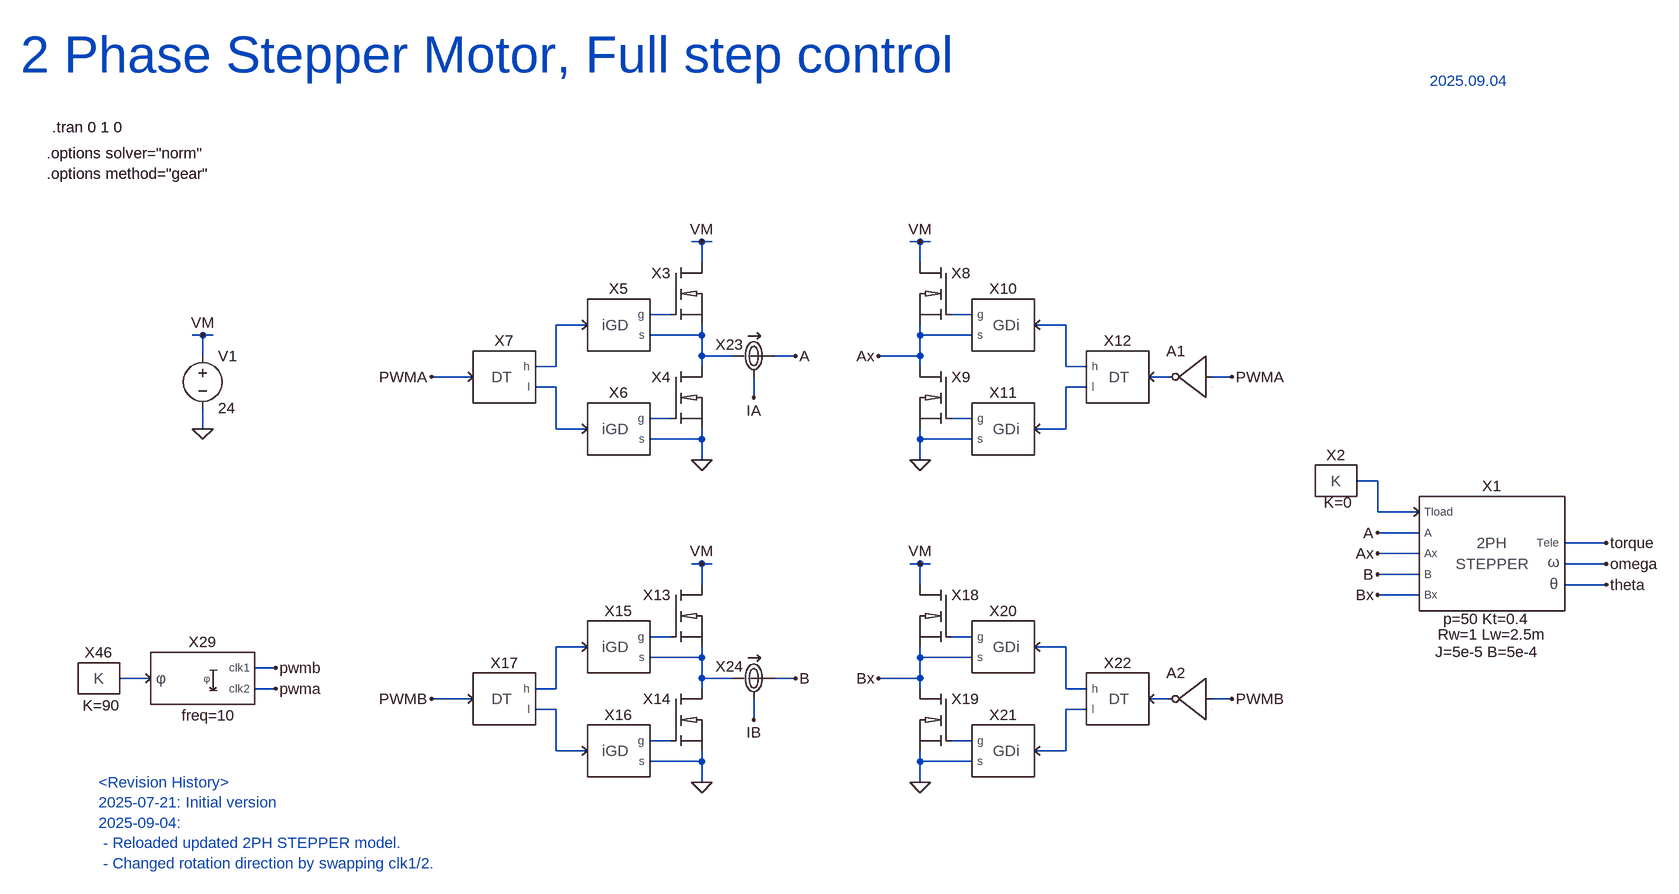
[diagram p0: schematic STEP2PH_FSTEP.asc]
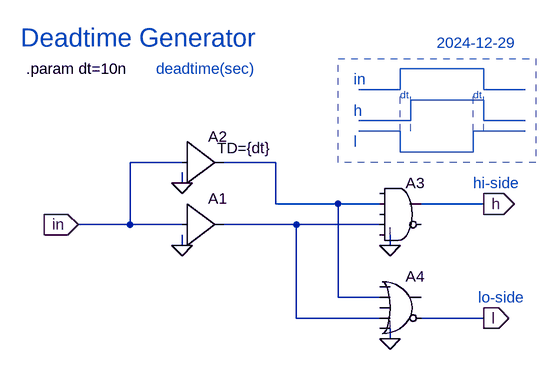
[diagram p1: sub-circuit deadtime.asc]
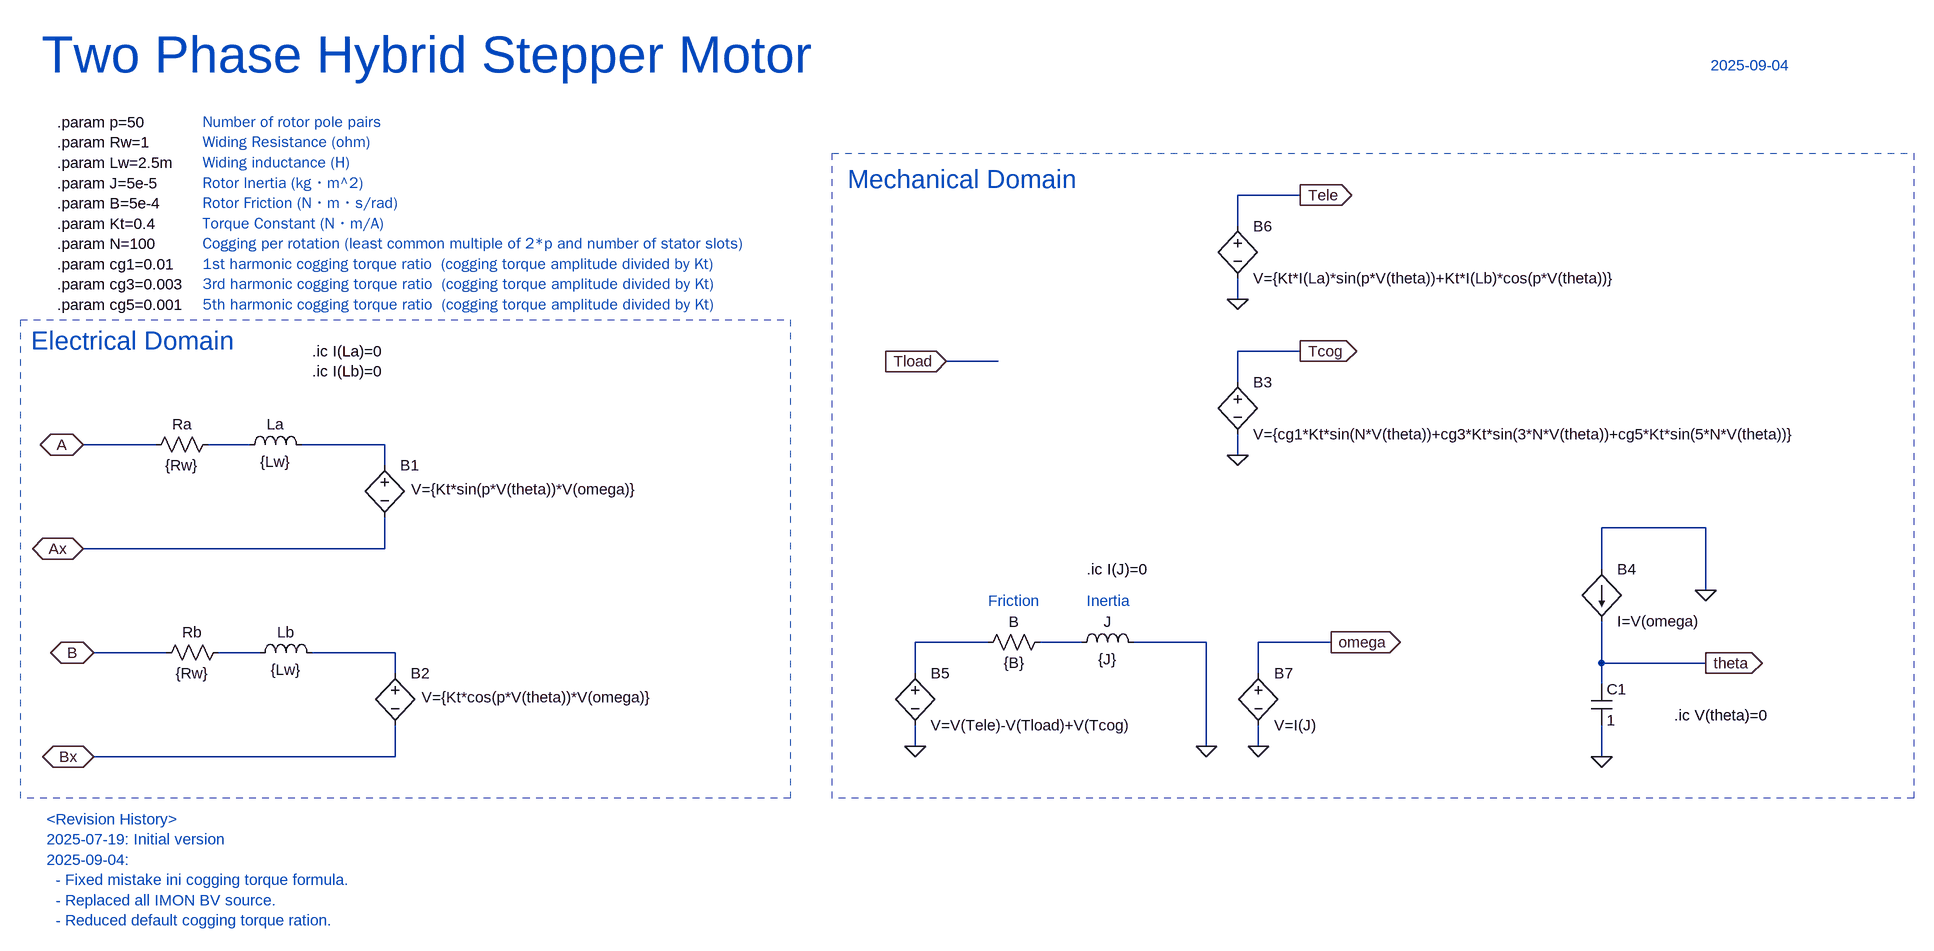
[diagram p2: sub-circuit stepper_2ph.asc]
STEP2PH_FSTEP.asc, the LTspice schematic file:
Version 4.1
SHEET 1 1580 2284
WIRE -288 -160 -304 -160
WIRE -272 -160 -288 -160
WIRE 48 -160 32 -160
WIRE 64 -160 48 -160
WIRE -288 -128 -288 -160
WIRE 48 -128 48 -160
WIRE -336 -48 -368 -48
WIRE 128 -48 96 -48
WIRE -464 -32 -512 -32
WIRE 272 -32 224 -32
WIRE -1056 -16 -1072 -16
WIRE -1040 -16 -1056 -16
WIRE -288 -16 -288 -32
WIRE -288 -16 -368 -16
WIRE 48 -16 48 -32
WIRE 128 -16 48 -16
WIRE -1056 16 -1056 -16
WIRE -288 16 -288 -16
WIRE -240 16 -288 16
WIRE -144 16 -176 16
WIRE 48 16 48 -16
WIRE 48 16 -16 16
WIRE -512 32 -512 -32
WIRE -512 32 -544 32
WIRE -288 32 -288 16
WIRE 48 32 48 16
WIRE 272 32 272 -32
WIRE 304 32 272 32
WIRE -640 48 -704 48
WIRE 432 48 400 48
WIRE 528 48 496 48
WIRE -512 64 -544 64
WIRE 304 64 272 64
WIRE -208 80 -208 48
WIRE -336 112 -368 112
WIRE 128 112 96 112
WIRE -1056 128 -1056 96
WIRE -512 128 -512 64
WIRE -464 128 -512 128
WIRE 272 128 272 64
WIRE 272 128 224 128
WIRE -288 144 -288 128
WIRE -288 144 -368 144
WIRE 48 144 48 128
WIRE 128 144 48 144
WIRE -288 176 -288 144
WIRE 48 176 48 144
WIRE 752 208 720 208
WIRE 752 256 752 208
WIRE 816 256 752 256
WIRE 816 288 752 288
WIRE 1104 304 1040 304
WIRE 816 320 752 320
WIRE -288 336 -304 336
WIRE -272 336 -288 336
WIRE 48 336 32 336
WIRE 64 336 48 336
WIRE 1104 336 1040 336
WIRE 816 352 752 352
WIRE -288 368 -288 336
WIRE 48 368 48 336
WIRE 1104 368 1040 368
WIRE 816 384 752 384
WIRE -336 448 -368 448
WIRE 128 448 96 448
WIRE -464 464 -512 464
WIRE 272 464 224 464
WIRE -288 480 -288 464
WIRE -288 480 -368 480
WIRE 48 480 48 464
WIRE 128 480 48 480
WIRE -944 496 -976 496
WIRE -1136 512 -1184 512
WIRE -288 512 -288 480
WIRE -240 512 -288 512
WIRE -144 512 -176 512
WIRE 48 512 48 480
WIRE 48 512 -16 512
WIRE -944 528 -976 528
WIRE -512 528 -512 464
WIRE -512 528 -544 528
WIRE -288 528 -288 512
WIRE 48 528 48 512
WIRE 272 528 272 464
WIRE 304 528 272 528
WIRE -640 544 -704 544
WIRE 432 544 400 544
WIRE 528 544 496 544
WIRE -512 560 -544 560
WIRE 304 560 272 560
WIRE -208 576 -208 544
WIRE -336 608 -368 608
WIRE 128 608 96 608
WIRE -512 624 -512 560
WIRE -464 624 -512 624
WIRE 272 624 272 560
WIRE 272 624 224 624
WIRE -288 640 -288 624
WIRE -288 640 -368 640
WIRE 48 640 48 624
WIRE 128 640 48 640
WIRE -288 672 -288 640
WIRE 48 672 48 640
FLAG 1104 336 omega
FLAG 1104 368 theta
FLAG -288 176 0
FLAG -144 16 A
FLAG 752 288 A
FLAG 752 320 Ax
FLAG 752 352 B
FLAG 752 384 Bx
FLAG -288 -160 VM
FLAG 48 176 0
FLAG -16 16 Ax
FLAG 48 -160 VM
FLAG -704 48 PWMA
FLAG 528 48 PWMA
FLAG 1104 304 torque
FLAG -288 672 0
FLAG -144 512 B
FLAG -288 336 VM
FLAG 48 672 0
FLAG -16 512 Bx
FLAG 48 336 VM
FLAG -704 544 PWMB
FLAG 528 544 PWMB
FLAG -1056 128 0
FLAG -1056 -16 VM
FLAG -208 80 IA
FLAG -208 576 IB
FLAG -944 496 pwmb
FLAG -944 528 pwma
SYMBOL CONST 688 208 R0
WINDOW 39 3 49 Bottom 2
SYMATTR SpiceLine K=0
SYMATTR InstName X2
SYMBOL iNMOS -288 -80 R0
SYMATTR InstName X3
SYMBOL iNMOS -288 80 R0
SYMATTR InstName X4
SYMBOL iGD -416 -32 R0
SYMATTR InstName X5
SYMBOL iGD -416 128 R0
SYMATTR InstName X6
SYMBOL DEADTIME -592 48 R0
SYMATTR InstName X7
SYMBOL iNMOS 48 -80 M0
SYMATTR InstName X8
SYMBOL iNMOS 48 80 M0
SYMATTR InstName X9
SYMBOL iGD 176 -32 M0
SYMATTR InstName X10
SYMBOL iGD 176 128 M0
SYMATTR InstName X11
SYMBOL DEADTIME 352 48 M0
SYMATTR InstName X12
SYMBOL Digital\\inv 496 -16 M0
SYMATTR InstName A1
SYMBOL iNMOS -288 416 R0
SYMATTR InstName X13
SYMBOL iNMOS -288 576 R0
SYMATTR InstName X14
SYMBOL iGD -416 464 R0
SYMATTR InstName X15
SYMBOL iGD -416 624 R0
SYMATTR InstName X16
SYMBOL DEADTIME -592 544 R0
SYMATTR InstName X17
SYMBOL iNMOS 48 416 M0
SYMATTR InstName X18
SYMBOL iNMOS 48 576 M0
SYMATTR InstName X19
SYMBOL iGD 176 464 M0
SYMATTR InstName X20
SYMBOL iGD 176 624 M0
SYMATTR InstName X21
SYMBOL DEADTIME 352 544 M0
SYMATTR InstName X22
SYMBOL Digital\\inv 496 480 M0
SYMATTR InstName A2
SYMBOL voltage -1056 0 R0
SYMATTR InstName V1
SYMATTR Value 24
SYMBOL IMON -208 16 R0
SYMATTR InstName X23
SYMBOL IMON -208 512 R0
SYMATTR InstName X24
SYMBOL PHASESHIFT -1056 512 R0
WINDOW 39 9 73 Bottom 2
SYMATTR SpiceLine freq=10
SYMATTR InstName X29
SYMBOL CONST -1216 512 R0
WINDOW 39 4 57 Bottom 2
SYMATTR SpiceLine K=90
SYMATTR InstName X46
SYMBOL STEPPER_2PH 928 320 R0
WINDOW 3 -9 116 Bottom 2
WINDOW 123 1 140 Bottom 2
WINDOW 39 -7 167 Bottom 2
SYMATTR InstName X1
TEXT -1288 -336 Left 2 !.tran 0 1 0
TEXT -1296 -296 Left 2 !.options solver="norm"\n.options method="gear"
TEXT -1336 -448 Left 6 ;2 Phase Stepper Motor, Full step control
TEXT 832 -408 Left 2 ;2025.09.04
TEXT -1216 672 Left 2 ;<Revision History>\n2025-07-21: Initial version\n2025-09-04: \n - Reloaded updated 2PH STEPPER model.\n - Changed rotation direction by swapping clk1/2.

deadtime.asc, the sub-circuit schematic file:
Version 4
SHEET 1 1412 1312
WIRE 64 288 -16 288
WIRE 208 288 128 288
WIRE 64 320 64 304
WIRE 208 352 208 288
WIRE 304 352 208 352
WIRE 368 352 304 352
WIRE 528 352 432 352
WIRE -16 384 -16 288
WIRE -16 384 -96 384
WIRE 64 384 -16 384
WIRE 240 384 128 384
WIRE 368 384 240 384
WIRE 64 416 64 400
WIRE 384 416 384 400
WIRE 304 496 304 352
WIRE 368 496 304 496
WIRE 240 528 240 384
WIRE 368 528 240 528
WIRE 528 528 432 528
WIRE 384 560 384 544
FLAG -96 384 in
IOPIN -96 384 In
FLAG 64 416 0
FLAG 64 320 0
FLAG 384 416 0
FLAG 384 560 0
FLAG 528 352 h
IOPIN 528 352 Out
FLAG 528 528 l
IOPIN 528 528 Out
SYMBOL Digital\\buf1 64 320 R0
SYMATTR InstName A1
SYMBOL Digital\\buf1 64 224 R0
WINDOW 3 54 42 Left 2
SYMATTR Value TD={dt}
SYMATTR InstName A2
SYMBOL Digital\\and 400 304 R0
SYMATTR InstName A3
SYMBOL Digital\\or 400 448 R0
SYMATTR InstName A4
TEXT -176 144 Left 2 !.param dt=10n
TEXT -184 96 Left 4 ;Deadtime Generator
TEXT 24 144 Left 2 ;deadtime(sec)
TEXT 512 320 Left 2 ;hi-side
TEXT 520 496 Left 2 ;lo-side
TEXT 328 160 Left 2 ;in
TEXT 328 208 Left 2 ;h
TEXT 328 256 Left 2 ;l
TEXT 400 184 Left 1 ;dt
TEXT 512 184 Left 1 ;dt
TEXT 456 104 Left 2 ;2024-12-29
LINE Normal 400 176 336 176
LINE Normal 400 176 400 144
LINE Normal 528 144 400 144
LINE Normal 528 176 528 144
LINE Normal 592 176 528 176
LINE Normal 416 224 336 224
LINE Normal 416 224 416 192
LINE Normal 528 192 416 192
LINE Normal 528 224 528 192
LINE Normal 592 224 528 224
LINE Normal 400 240 336 240
LINE Normal 400 272 400 240
LINE Normal 512 272 400 272
LINE Normal 512 272 512 240
LINE Normal 592 240 512 240
LINE Normal 400 240 400 176 2
LINE Normal 512 240 512 176 2
LINE Normal 416 240 416 176 2
LINE Normal 528 240 528 176 2
RECTANGLE Normal 608 288 304 128 2

stepper_2ph.asc, the sub-circuit schematic file:
Version 4.1
SHEET 1 2756 2296
WIRE 1808 256 1712 256
WIRE 1712 304 1712 256
WIRE 1712 416 1712 384
WIRE 1808 496 1712 496
WIRE 1344 512 1264 512
WIRE 1712 544 1712 496
WIRE 48 640 -64 640
WIRE 192 640 128 640
WIRE 400 640 272 640
WIRE 1712 656 1712 624
WIRE 400 672 400 640
WIRE 2432 768 2272 768
WIRE 400 800 400 752
WIRE 400 800 -64 800
WIRE 2272 832 2272 768
WIRE 2432 864 2432 768
WIRE 1328 944 1216 944
WIRE 1472 944 1408 944
WIRE 1664 944 1552 944
WIRE 1856 944 1744 944
WIRE 64 960 -48 960
WIRE 208 960 144 960
WIRE 416 960 288 960
WIRE 2272 976 2272 912
WIRE 2432 976 2272 976
WIRE 416 992 416 960
WIRE 1216 992 1216 944
WIRE 1744 992 1744 944
WIRE 2272 1008 2272 976
WIRE 1216 1104 1216 1072
WIRE 1664 1104 1664 944
WIRE 1744 1104 1744 1072
WIRE 416 1120 416 1072
WIRE 416 1120 -48 1120
WIRE 2272 1120 2272 1072
FLAG 1712 656 0
FLAG 1216 1104 0
FLAG 2272 1120 0
FLAG 1264 512 Tload
IOPIN 1264 512 In
FLAG -64 640 A
IOPIN -64 640 BiDir
FLAG -64 800 Ax
IOPIN -64 800 BiDir
FLAG -48 960 B
IOPIN -48 960 BiDir
FLAG -48 1120 Bx
IOPIN -48 1120 BiDir
FLAG 2432 976 theta
IOPIN 2432 976 Out
FLAG 1808 496 Tcog
IOPIN 1808 496 Out
FLAG 1664 1104 0
FLAG 2432 864 0
FLAG 1712 416 0
FLAG 1808 256 Tele
IOPIN 1808 256 Out
FLAG 1744 1104 0
FLAG 1856 944 omega
IOPIN 1856 944 Out
SYMBOL res 144 624 R90
WINDOW 0 0 56 VBottom 2
WINDOW 3 32 56 VTop 2
SYMATTR InstName Ra
SYMATTR Value {Rw}
SYMBOL ind 176 656 R270
WINDOW 0 32 56 VTop 2
WINDOW 3 5 56 VBottom 2
SYMATTR InstName La
SYMATTR Value {Lw}
SYMBOL res 160 944 R90
WINDOW 0 0 56 VBottom 2
WINDOW 3 32 56 VTop 2
SYMATTR InstName Rb
SYMATTR Value {Rw}
SYMBOL ind 192 976 R270
WINDOW 0 32 56 VTop 2
WINDOW 3 5 56 VBottom 2
SYMATTR InstName Lb
SYMATTR Value {Lw}
SYMBOL bv 416 976 R0
WINDOW 3 41 53 Left 2
SYMATTR Value V={Kt*cos(p*V(theta))*V(omega)}
SYMATTR InstName B2
SYMBOL bv 1712 528 R0
SYMATTR InstName B3
SYMATTR Value V={cg1*Kt*sin(N*V(theta))+cg3*Kt*sin(3*N*V(theta))+cg5*Kt*sin(5*N*V(theta))}
SYMBOL ind 1456 960 R270
WINDOW 0 32 56 VTop 2
WINDOW 3 5 56 VBottom 2
SYMATTR InstName J
SYMATTR Value {J}
SYMBOL bv 1216 976 R0
SYMATTR InstName B5
SYMATTR Value V=V(Tele)-V(Tload)+V(Tcog)
SYMBOL cap 2256 1008 R0
SYMATTR InstName C1
SYMATTR Value 1
SYMBOL res 1424 928 R90
WINDOW 0 0 56 VBottom 2
WINDOW 3 32 56 VTop 2
SYMATTR InstName B
SYMATTR Value {B}
SYMBOL bi 2272 832 R0
SYMATTR InstName B4
SYMATTR Value I=V(omega)
SYMBOL bv 400 656 R0
WINDOW 3 41 53 Left 2
SYMATTR Value V={Kt*sin(p*V(theta))*V(omega)}
SYMATTR InstName B1
SYMBOL bv 1712 288 R0
SYMATTR InstName B6
SYMATTR Value V={Kt*I(La)*sin(p*V(theta))+Kt*I(Lb)*cos(p*V(theta))}
SYMBOL bv 1744 976 R0
SYMATTR InstName B7
SYMATTR Value V=I(J)
TEXT -104 144 Left 2 !.param p=50\n.param Rw=1\n.param Lw=2.5m\n.param J=5e-5\n.param B=5e-4\n.param Kt=0.4\n.param N=100\n.param cg1=0.01\n.param cg3=0.003\n.param cg5=0.001
TEXT -128 40 Left 6 ;Two Phase Hybrid Stepper Motor
TEXT 2440 56 Left 2 ;2025-09-04
TEXT 2384 1056 Left 2 !.ic V(theta)=0
TEXT 1480 832 Left 2 !.ic I(J)=0
TEXT 1480 880 Left 2 ;Inertia
TEXT 1328 880 Left 2 ;Friction
TEXT 288 496 Left 2 !.ic I(La)=0\n.ic I(Lb)=0
TEXT 120 144 Left 2 ;Number of rotor pole pairs\nWiding Resistance (ohm)\nWiding inductance (H)\nRotor Inertia (kg・m^2)\nRotor Friction (N・m・s/rad)\nTorque Constant (N・m/A)\nCogging per rotation (least common multiple of 2*p and number of stator slots)\n1st harmonic cogging torque ratio  (cogging torque amplitude divided by Kt)\n3rd harmonic cogging torque ratio  (cogging torque amplitude divided by Kt)\n5th harmonic cogging torque ratio  (cogging torque amplitude divided by Kt)
TEXT -120 1216 Left 2 ;<Revision History>\n2025-07-19: Initial version\n2025-09-04: \n  - Fixed mistake ini cogging torque formula.\n  - Replaced all IMON BV source.\n  - Reduced default cogging torque ration.
TEXT -144 480 Left 4 ;Electrical Domain
TEXT 1112 232 Left 4 ;Mechanical Domain
RECTANGLE Normal 1024 1184 -160 448 2
RECTANGLE Normal 2752 1184 1088 192 2

The netlist it stands for:
* STEP2PH_FSTEP.asc
X§X2 N011 CONST K=0  ; pins K
X§X3 VM N001 N005 iNMOS params: esl=1f rsnb=1k csnb=10p ron=10m  ; pins D G S
X§X4 N005 N009 0 iNMOS params: esl=1f rsnb=1k csnb=10p ron=10m  ; pins D G S
X§X5 N003 N001 N005 iGD  ; pins in g s
X§X6 N007 N009 0 iGD  ; pins in g s
X§X7 PWMA N007 N003 deadtime params: dt=10n
X§X8 VM N002 Ax iNMOS params: esl=1f rsnb=1k csnb=10p ron=10m  ; pins D G S
X§X9 Ax N010 0 iNMOS params: esl=1f rsnb=1k csnb=10p ron=10m  ; pins D G S
X§X10 N004 N002 Ax iGD  ; pins in g s
X§X11 N008 N010 0 iGD  ; pins in g s
X§X12 N006 N008 N004 deadtime params: dt=10n
A1 PWMA 0 0 0 0 N006 0 0 BUF
X§X13 VM N012 N016 iNMOS params: esl=1f rsnb=1k csnb=10p ron=10m  ; pins D G S
X§X14 N016 N021 0 iNMOS params: esl=1f rsnb=1k csnb=10p ron=10m  ; pins D G S
X§X15 N014 N012 N016 iGD  ; pins in g s
X§X16 N019 N021 0 iGD  ; pins in g s
X§X17 PWMB N019 N014 deadtime params: dt=10n
X§X18 VM N013 Bx iNMOS params: esl=1f rsnb=1k csnb=10p ron=10m  ; pins D G S
X§X19 Bx N022 0 iNMOS params: esl=1f rsnb=1k csnb=10p ron=10m  ; pins D G S
X§X20 N015 N013 Bx iGD  ; pins in g s
X§X21 N020 N022 0 iGD  ; pins in g s
X§X22 N018 N020 N015 deadtime params: dt=10n
A2 PWMB 0 0 0 0 N018 0 0 BUF
V1 VM 0 24
X§X23 A IA N005 IMON rsns=10u  ; pins n out p
X§X24 B IB N016 IMON rsns=10u  ; pins n out p
X§X29 N017 PWMB PWMA PHASESHIFT freq=10  ; pins phase clk1 clk2
X§X46 N017 CONST K=90  ; pins K
X§X1 N011 A Ax B Bx omega torque theta stepper_2ph params: p=50 Kt=0.4 Rw=1 Lw=2.5m J=5e-5 B=5e-4 N=100 cg1=0.05 cg3=0.015 cg5=0.005

* block symbol definitions
.subckt deadtime in l h
A1 in 0 0 0 0 0 N002 0 BUF
A2 in 0 0 0 0 0 N001 0 BUF TD={dt}
A3 0 N001 0 N002 0 0 h 0 AND
A4 0 N001 0 N002 0 l 0 0 OR
.param dt=10n
* Deadtime Generator
* deadtime(sec)
* hi-side
* lo-side
* in
* h
* l
* dt
* dt
* 2024-12-29
.ends deadtime

.subckt stepper_2ph Tload A Ax B Bx omega Tele theta
Ra N001 A {Rw}
La N001 N002 {Lw}
Rb N005 B {Rw}
Lb N005 N006 {Lw}
B2 N006 Bx V={Kt*cos(p*V(theta))*V(omega)}
B3 Tcog 0 V={cg1*Kt*sin(N*V(theta))+cg3*Kt*sin(3*N*V(theta))+cg5*Kt*sin(5*N*V(theta))}
L§J N004 0 {J}
B5 N003 0 V=V(Tele)-V(Tload)+V(Tcog)
C1 theta 0 1
R§B N004 N003 {B}
B4 0 theta I=V(omega)
B1 N002 Ax V={Kt*sin(p*V(theta))*V(omega)}
B6 Tele 0 V={Kt*I(La)*sin(p*V(theta))+Kt*I(Lb)*cos(p*V(theta))}
B7 omega 0 V=I(J)
.param p=50
.param Rw=1
.param Lw=2.5m
.param J=5e-5
.param B=5e-4
.param Kt=0.4
.param N=100
.param cg1=0.01
.param cg3=0.003
.param cg5=0.001
* Two Phase Hybrid Stepper Motor
* 2025-09-04
.ic V(theta)=0
.ic I(J)=0
* Inertia
* Friction
.ic I(La)=0
.ic I(Lb)=0
* Number of rotor pole pairs
* Widing Resistance (ohm)
* Widing inductance (H)
* Rotor Inertia (kg・m^2)
* Rotor Friction (N・m・s/rad)
* Torque Constant (N・m/A)
* Cogging per rotation (least common multiple of 2*p and number of stator slots)
* 1st harmonic cogging torque ratio  (cogging torque amplitude divided by Kt)
* 3rd harmonic cogging torque ratio  (cogging torque amplitude divided by Kt)
* 5th harmonic cogging torque ratio  (cogging torque amplitude divided by Kt)
* <Revision History>
* 2025-07-19: Initial version
* 2025-09-04:
*   - Fixed mistake ini cogging torque formula.
*   - Replaced all IMON BV source.
*   - Reduced default cogging torque ration.
* Electrical Domain
* Mechanical Domain
.ends stepper_2ph

.tran 0 1 0
.options solver="norm"
.options method="gear"
* 2 Phase Stepper Motor, Full step control
* 2025.09.04
* <Revision History>
* 2025-07-21: Initial version
* 2025-09-04:
*  - Reloaded updated 2PH STEPPER model.
*  - Changed rotation direction by swapping clk1/2.
.backanno
.end